# EAGLE design board (EAGLE 6.6.0)
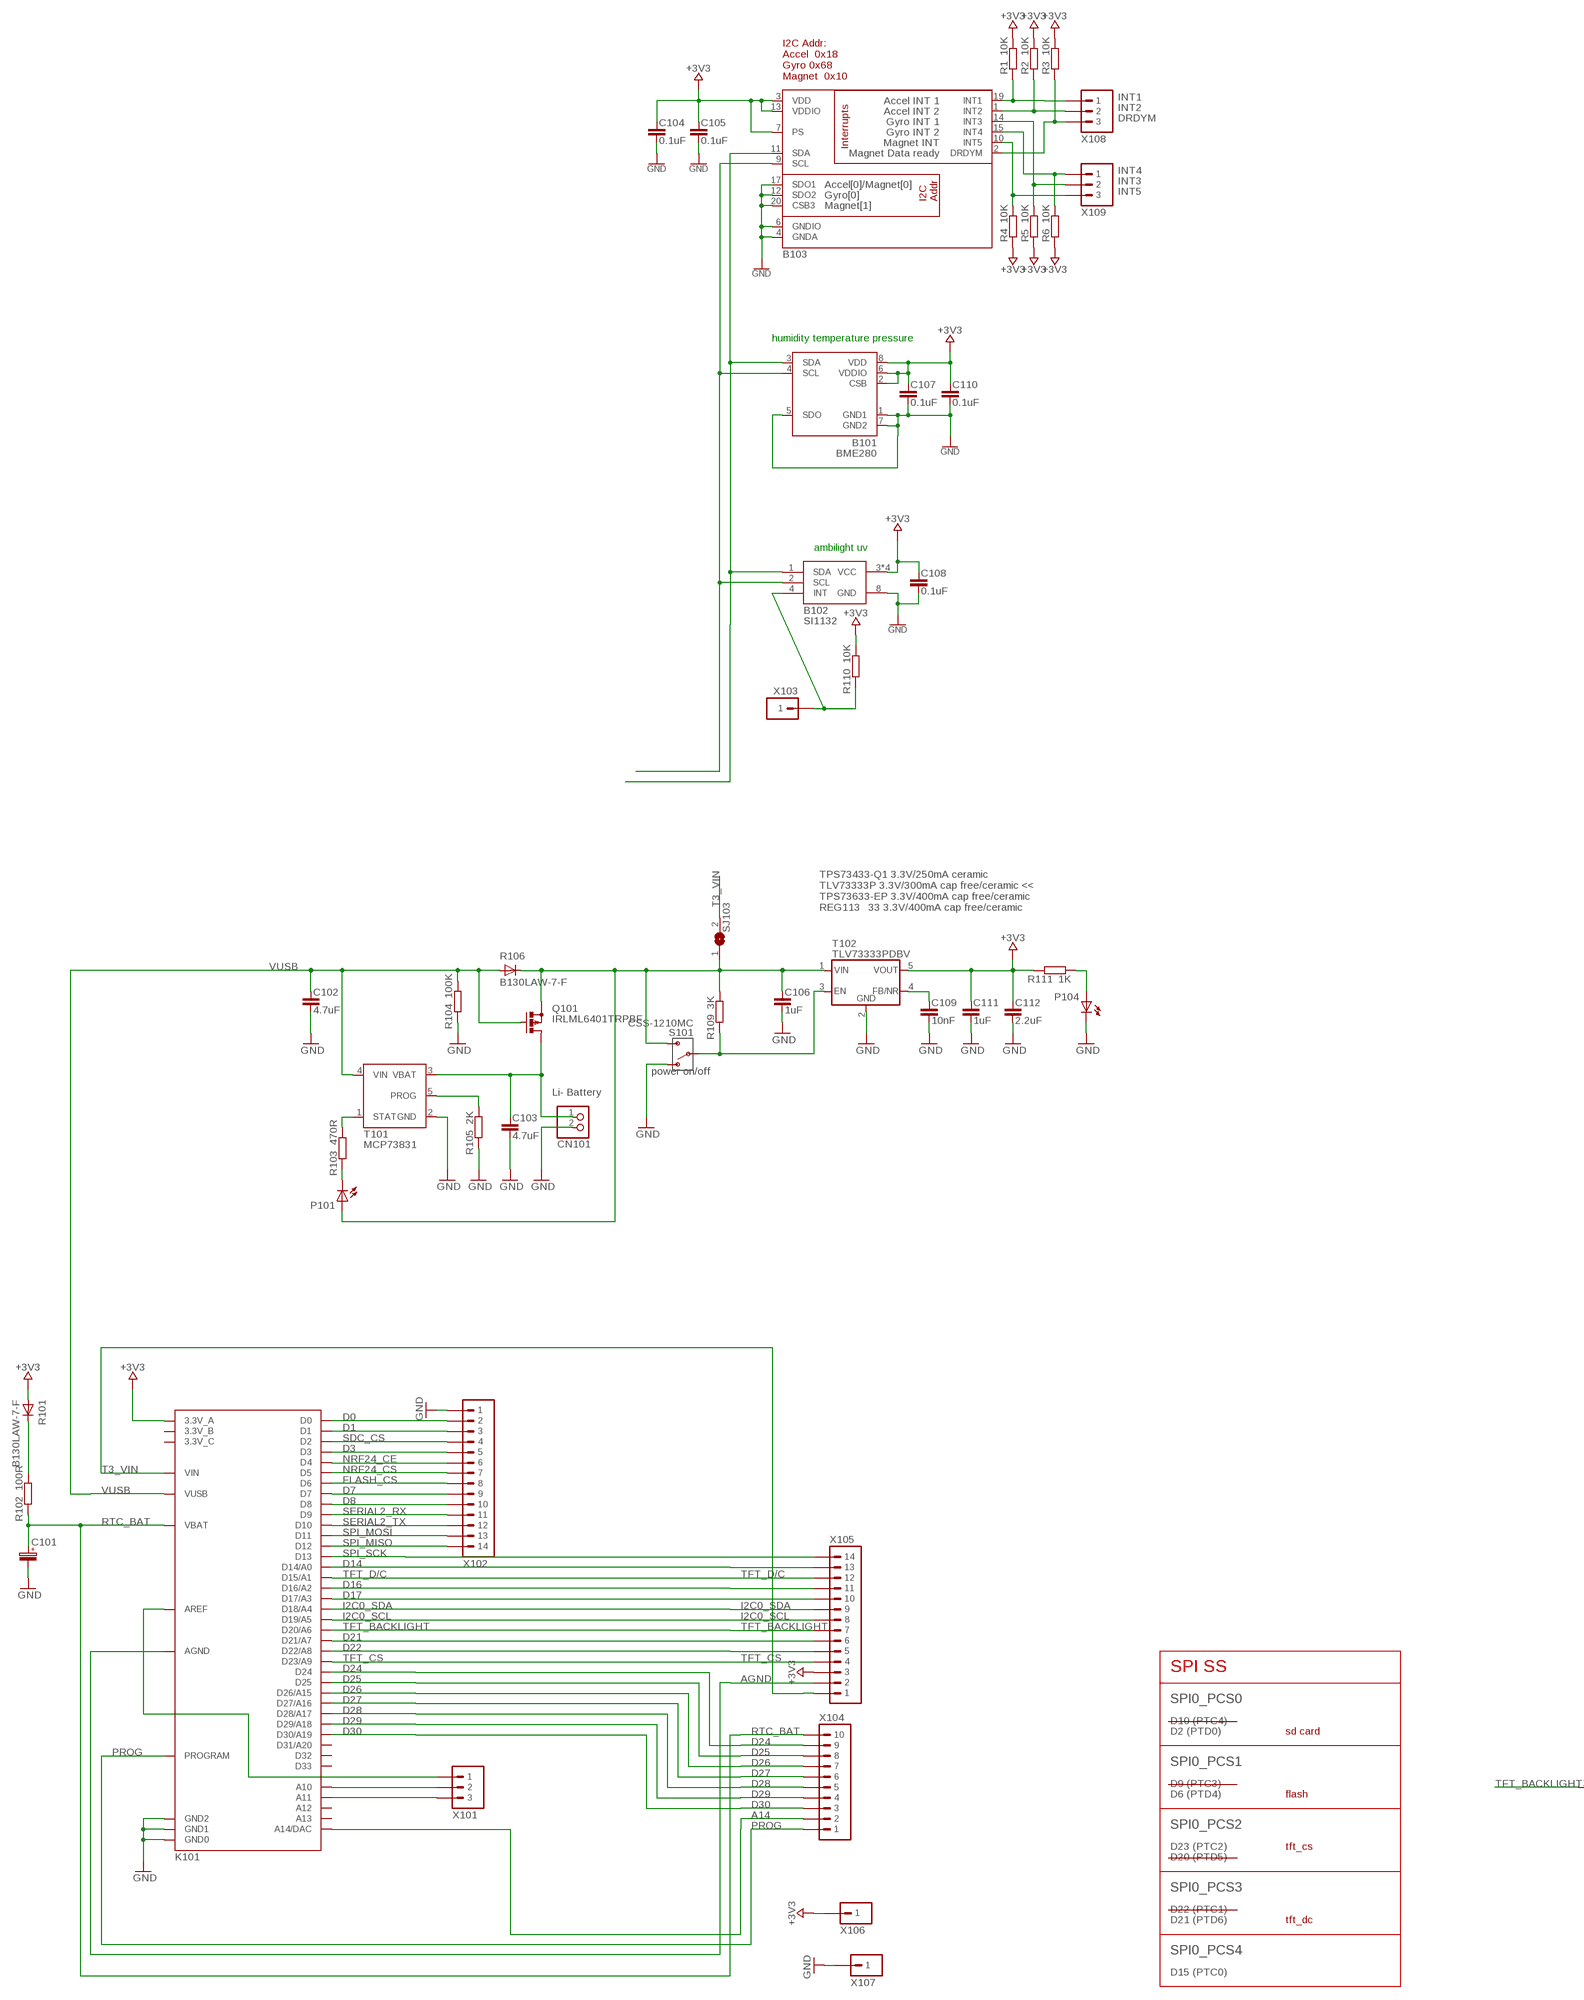
[diagram p0: schematic, sheet 1, part 1 of 2]
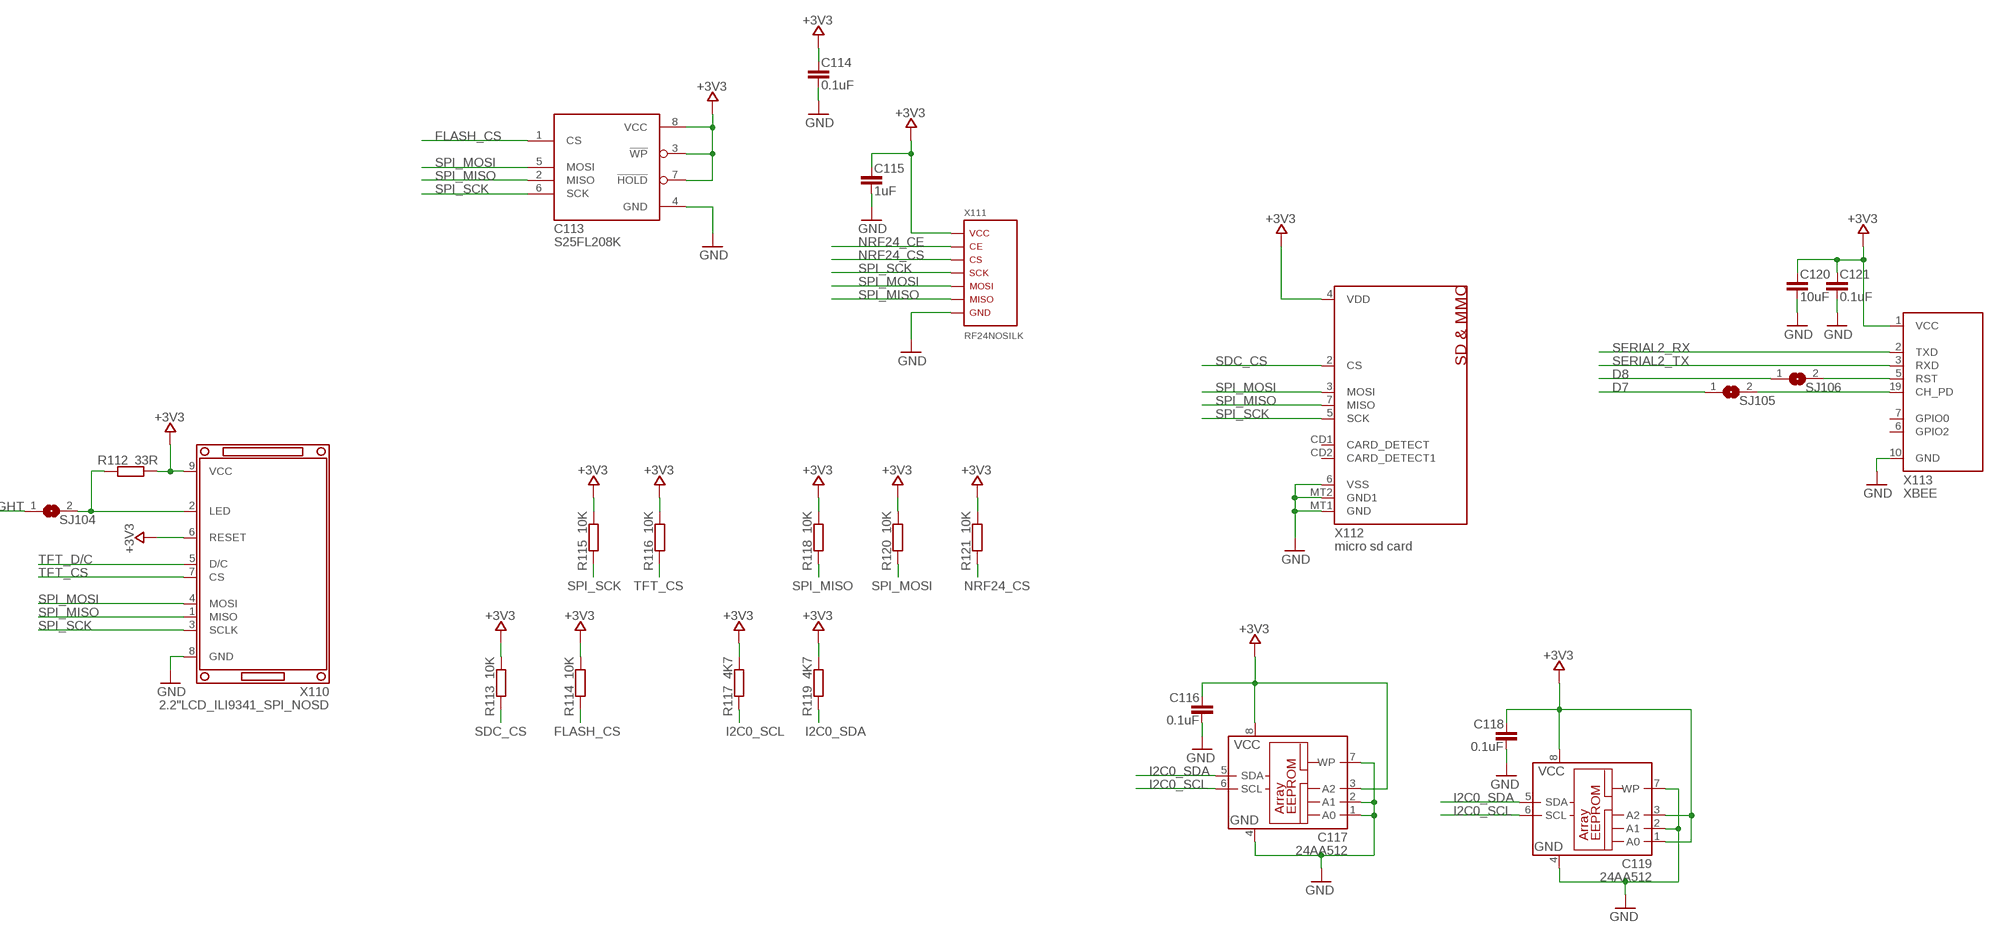
[diagram p1: schematic, sheet 1, part 2 of 2]

## Parts
B101  BME280  BME280_I2CLGA8  [BOSCH_8LGA_0.35X0.35]
B102  SI1132  SI1132QFN10  [SILABS_QFN-10_(ONLY_8PAD)]
B103  BMX055  [BMX055_LGA20]
C101  CAPACITOR_POLCPH3225A  [CPH3225A]
C102  4.7uF  CAPACITORM2012(0805)_G1  [SMT_M2012(0805)_G1]
C103  4.7uF  CAPACITORM2012(0805)_G1  [SMT_M2012(0805)_G1]
C104  0.1uF  CAPACITORM1608(0603)_G1  [SMT_M1608(0603)_G1]
C105  0.1uF  CAPACITORM1608(0603)_G1  [SMT_M1608(0603)_G1]
C106  1uF  CAPACITORM1608(0603)_G1  [SMT_M1608(0603)_G1]
C107  0.1uF  CAPACITORM1608(0603)_G1  [SMT_M1608(0603)_G1]
C108  0.1uF  CAPACITORM1608(0603)_G1  [SMT_M1608(0603)_G1]
C109  10nF  CAPACITORM1608(0603)_G1  [SMT_M1608(0603)_G1]
C110  0.1uF  CAPACITORM1608(0603)_G1  [SMT_M1608(0603)_G1]
C111  1uF  CAPACITORM1608(0603)_G1  [SMT_M1608(0603)_G1]
C112  2.2uF  CAPACITORM2012(0805)_G1  [SMT_M2012(0805)_G1]
C113  S25FL208K  SPI_FLASH-X25XXSOIC_150MIL_2  [SOIC-8]
C114  0.1uF  CAPACITORM1608(0603)_G1  [SMT_M1608(0603)_G1]
C115  1uF  CAPACITORM1608(0603)_G1  [SMT_M1608(0603)_G1]
C116  0.1uF  CAPACITORM1608(0603)_G1  [SMT_M1608(0603)_G1]
C117  24AA512  EEPROM24AAXXXSN  [SOIC-8]
C118  0.1uF  CAPACITORM1608(0603)_G1  [SMT_M1608(0603)_G1]
C119  24AA512  EEPROM24AAXXXSN  [SOIC-8]
C120  10uF  CAPACITORM2012(0805)_G1  [SMT_M2012(0805)_G1]
C121  0.1uF  CAPACITORM1608(0603)_G1  [SMT_M1608(0603)_G1]
CN101  JST_2PIN-SMT-RA  [JST-PH-2-SMT-RA]
K101  TEENSY3.1_ALLPINSNOSILK  [TEENSY3.1_ALLPINS/NOSILK]
P101  LEDSMT_M1608(0603)_LED_G1  [SMT_M1608(0603)_LED_G1]
P104  LEDSMT_M1608(0603)_LED_G1  [SMT_M1608(0603)_LED_G1]
Q101  IRLML6401TRPBF  PFETSOT-23_SPEC1  [SOT23-SPEC1]
R1  10K  RESISTORM1608(0603)_G1  [SMT_M1608(0603)_G1]
R2  10K  RESISTORM1608(0603)_G1  [SMT_M1608(0603)_G1]
R3  10K  RESISTORM1608(0603)_G1  [SMT_M1608(0603)_G1]
R4  10K  RESISTORM1608(0603)_G1  [SMT_M1608(0603)_G1]
R5  10K  RESISTORM1608(0603)_G1  [SMT_M1608(0603)_G1]
R6  10K  RESISTORM1608(0603)_G1  [SMT_M1608(0603)_G1]
R101  B130LAW-7-F  DIODESOD123-V2  [SOD123V2]
R102  100R  RESISTORM1608(0603)_G1  [SMT_M1608(0603)_G1]
R103  470R  RESISTORM1608(0603)_G1  [SMT_M1608(0603)_G1]
R104  100K  RESISTORM1608(0603)_G1  [SMT_M1608(0603)_G1]
R105  2K  RESISTORM1608(0603)_G1  [SMT_M1608(0603)_G1]
R106  B130LAW-7-F  DIODESOD123-V2  [SOD123V2]
R109  3K  RESISTORM1608(0603)_G1  [SMT_M1608(0603)_G1]
R110  10K  RESISTORM1608(0603)_G1  [SMT_M1608(0603)_G1]
R111  1K  RESISTORM1608(0603)_G1  [SMT_M1608(0603)_G1]
R112  33R  RESISTORM1608(0603)_G1  [SMT_M1608(0603)_G1]
R113  10K  RESISTORM1608(0603)_G1  [SMT_M1608(0603)_G1]
R114  10K  RESISTORM1608(0603)_G1  [SMT_M1608(0603)_G1]
R115  10K  RESISTORM1608(0603)_G1  [SMT_M1608(0603)_G1]
R116  10K  RESISTORM1608(0603)_G1  [SMT_M1608(0603)_G1]
R117  4K7  RESISTORM1608(0603)_G1  [SMT_M1608(0603)_G1]
R118  10K  RESISTORM1608(0603)_G1  [SMT_M1608(0603)_G1]
R119  4K7  RESISTORM1608(0603)_G1  [SMT_M1608(0603)_G1]
R120  10K  RESISTORM1608(0603)_G1  [SMT_M1608(0603)_G1]
R121  10K  RESISTORM1608(0603)_G1  [SMT_M1608(0603)_G1]
S101  CSS-1210MC  SLIDE_SWITCH_2WAYCSS-1210(M)C  [CSS-1210(M)C]
SJ103  n/a  JUMPER_2WRESISTOR0603  [SMT_M1608(0603)_G1]
SJ104  n/a  JUMPER_2WRESISTOR0603  [SMT_M1608(0603)_G1]
SJ105  0R  JUMPER_2WRESISTOR0603  [SMT_M1608(0603)_G1]
SJ106  0R  JUMPER_2WRESISTOR0603  [SMT_M1608(0603)_G1]
T101  MCP73831  MCP73831XXXX/OT_(SOT-23)  [SOT23-5_MICROCHIP]
T102  TLV73333PDBV  TPS736XXDBV_1  [R-PDSO-G5]
X101  3P1/MIN_SILK2  [HEADER_1X3_1/MIN_SILK2]
X102  14P1/MIN_SILK2  [HEADER_1X14_1/MIN_SILK2]
X103  1P1/MIN_SILK2  [HEADER_1X1_1/MIN_SILK2]
X104  10P1X10P_1/MIN_SILK2  [HEADER_1X10_1/MIN_SILK2]
X105  14P1/MIN_SILK2  [HEADER_1X14_1/MIN_SILK2]
X106  1P1/MIN_SILK2  [HEADER_1X1_1/MIN_SILK2]
X107  1P1/MIN_SILK2  [HEADER_1X1_1/MIN_SILK2]
X108  3P1/MIN_SILK2  [HEADER_1X3_1/MIN_SILK2]
X109  3P1/MIN_SILK2  [HEADER_1X3_1/MIN_SILK2]
X110  2.2"LCD_ILI9341_SPI_NOSD  [2.2_TFT1]
X111  RF24NOSILK  [RF24_NOSILK]
X112  micro sd card  MICROSD  [MICROSD]
X113  XBEE  EXP-BEE-SMALLPTH  [ESP_BEE_PTH_VCC_GND_RX_TX_PD_RST_IO0_IO2]

## Nets
+3V3 [MOREPOWER]: B101.2(CSB) B101.6(VDDIO) B101.8(VDD) B102.3(VCC) B102.6(VCC) B102.7(VCC) B102.9(VCC) B103.3(VDD) B103.7(PS) B103.13(VDDIO) C104.1 C105.1 C107.1 C108.1 C110.1 C111.1 C112.1 C113.3(!WP) C113.7(!HOLD) C113.8(VCC) C114.1 C115.1 C116.1 C117.3(A2) C117.8(VCC) C118.1 C119.1(A0) C119.3(A2) C119.8(VCC) C120.1 C121.1 K101.3V3_A(3.3V_A) R1.2 R2.2 R3.2 R4.1 R5.1 R6.1 R101.A R110.2 R111.1 R112.2 R113.2 R114.2 R115.2 R116.2 R117.2 R118.2 R119.2 R120.2 R121.2 T102.5(VOUT) X105.3 X106.1 X110.6(RESET) X110.9(VCC) X111.VCC X112.4(VDD) X113.1(VCC)
A14: K101.A14(A14/DAC) X104.2
AGND: K101.AGND X105.2
BAT_CHG_OUT [MOREPOWER]: C106.1 P101.A Q101.2(S) R106.K(C) R109.2 S101.2(S) SJ103.1 T102.1(VIN)
D0: K101.D0 X102.2
D1: K101.D1 X102.3
D3: K101.D3 X102.5
D7: K101.D7 SJ105.1 X102.9
D8: K101.D8 SJ106.1 X102.10
D14: K101.A0(D14/A0) X105.13
D16: K101.A2(D16/A2) X105.11
D17: K101.A3(D17/A3) X105.10
D21: K101.A7(D21/A7) X105.6
D22: K101.A8(D22/A8) X105.5
D24: K101.D24 X104.9
D25: K101.D25 X104.8
D26: K101.D26(D26/A15) X104.7
D27: K101.D27(D27/A16) X104.6
D28: K101.D28(D28/A17) X104.5
D29: K101.D29(D29/A18) X104.4
D30: K101.D30(D30/A19) X104.3
DRDYM: B103.2(DRDYM) R3.1 X108.3
ENABLE_POWER: R109.1 S101.3(P) T102.3(EN)
FLASH_CS: C113.1(CS) K101.D6 R114.1 X102.8
GND [MOREPOWER]: B101.1(GND1) B101.5(SDO) B101.7(GND2) B102.8(GND) B103.4(GNDA) B103.6(GNDIO) B103.12(SDO2) B103.17(SDO1) B103.20(CSB3) C101.- C102.2 C103.2 C104.2 C105.2 C106.2 C107.2 C108.2 C109.2 C110.2 C111.2 C112.2 C113.4(GND) C114.2 C115.2 C116.2 C117.1(A0) C117.2(A1) C117.4(GND) C117.7(WP) C118.2 C119.2(A1) C119.4(GND) C119.7(WP) C120.2 C121.2 CN101.2 K101.GND0 K101.GND1 K101.GND2 P104.C R104.1 R105.1 S101.1(O) T101.2(GND) T102.2(GND) X102.1 X107.1 X110.8(GND) X111.GND X112.6(VSS) X112.MT1(GND) X112.MT2(GND1) X113.10(GND)
I2C0_SCL: B101.4(SCL) B102.2(SCL) B103.9(SCL) C117.6(SCL) C119.6(SCL) K101.A5(D19/A5) R117.1 X105.8
I2C0_SDA: B101.3(SDA) B102.1(SDA) B103.11(SDA) C117.5(SDA) C119.5(SDA) K101.A4(D18/A4) R119.1 X105.9
INT1: B103.19(INT1) R1.1 X108.1
INT2: B103.1(INT2) R2.1 X108.2
INT3: B103.14(INT3) R5.2 X109.2
INT4: B103.15(INT4) R6.2 X109.1
INT5: B103.10(INT5) R4.2 X109.3
IO3: B102.4(INT) R110.1 X103.1
N$1: R105.2 T101.5(PROG)
N$2: R103.2 T101.1(STAT)
N$3: P101.C R103.1
N$4: P104.A R111.2
N$6: SJ106.2 X113.5(RST)
N$7: R101.K(C) R102.2
N$8: SJ105.2 X113.19(CH_PD)
N$10: K101.A11 X101.3
N$11: K101.A10 X101.2
N$12: K101.AREF X101.1
N$13: R112.1 SJ104.2 X110.2(LED)
N$18: C109.1 T102.4(FB/NR)
NRF24_CE: K101.D4 X102.6 X111.CE
NRF24_CS: K101.D5 R121.1 X102.7 X111.CS
PROG: K101.PROG(PROGRAM) X104.1
RTC_BAT: C101.+ K101.VBAT R102.1 X104.10
SDC_CS: K101.D2 R113.1 X102.4 X112.2(CS)
SERIAL2_RX: K101.D9 X102.11 X113.2(TXD)
SERIAL2_TX: K101.D10 X102.12 X113.3(RXD)
SPI_MISO: C113.2(MISO) K101.D12 R118.1 X102.14 X110.1(MISO) X111.MISO X112.7(MISO)
SPI_MOSI: C113.5(MOSI) K101.D11 R120.1 X102.13 X110.4(MOSI) X111.MOSI X112.3(MOSI)
SPI_SCK: C113.6(SCK) K101.D13 R115.1 X105.14 X110.3(SCLK) X111.SCK X112.5(SCK)
T3_VIN [POWER]: K101.VIN SJ103.2 X105.1
TFT_BACKLIGHT: K101.A6(D20/A6) SJ104.1 X105.7
TFT_CS: K101.A9(D23/A9) R116.1 X105.4 X110.7(CS)
TFT_D/C: K101.A1(D15/A1) X105.12 X110.5(D/C)
VBAT [POWER]: C103.1 CN101.1 Q101.3(D) T101.3(VBAT)
VUSB [POWER]: C102.1 K101.VUSB Q101.1(G) R104.2 R106.A T101.4(VIN)
Unconnected: K101.A12 K101.A13 K101.D31(D31/A20) K101.D32 K101.D33 X112.CD1(CARD_DETECT) X112.CD2(CARD_DETECT1) X113.6(GPIO2) X113.7(GPIO0)

## Notes on the sheet
- I2C Addr:
  Accel  0x18
  Gyro 0x68
  Magnet  0x10
- humidity temperature pressure
- ambilight uv
- TPS73433-Q1 3.3V/250mA ceramic
  TLV73333P 3.3V/300mA cap free/ceramic <<
  TPS73633-EP 3.3V/400mA cap free/ceramic
  REG113‑33 3.3V/400mA cap free/ceramic
- power on/off
- Li- Battery
- SPI SS
- SPI0_PCS0
- D10 (PTC4)
- D2 (PTD0) | sd card
- SPI0_PCS1
- D9 (PTC3)
- D6 (PTD4) | flash
- SPI0_PCS2
- D23 (PTC2) | tft_cs
- D20 (PTD5)
- SPI0_PCS3
- D22 (PTC1)
- D21 (PTD6) | tft_dc
- SPI0_PCS4
- D15 (PTC0)

## Power pins joined to a net without a drawn wire
3.3V_B: K101.3V3_B(3.3V_B)
3.3V_C: K101.3V3_C(3.3V_C)

## Library data of the parts
B101 = thewknd:BME280_I2C; OC_FARNELL: unknown
B102 = thewknd:SI1132; OC_FARNELL: unknown
B103 = thewknd:BMX055; OC_FARNELL: unknown
C101 = thewknd:CAPACITOR_POL; OC_FARNELL: unknown
C102 C103 = thewknd:CAPACITOR; DK: CGJ4J2X7R0J475K125AA; MF: AVX; MPN: 0805ZD475KAT2A; OC_FARNELL: 1327701
C104 C105 C107 C108 C110 C114 C116 C118 C121 = thewknd:CAPACITOR; MF: AVX; MPN: 0603YC104K4Z2A; OC_FARNELL: 1301716
C106 C111 C115 = thewknd:CAPACITOR; DK: CGJ4J2X7R0J475K125AA; MF: AVX; MPN: 0603ZD105KAT2A; OC_FARNELL: 1327684
C109 = thewknd:CAPACITOR; DK: CGJ4J2X7R0J475K125AA; MF: MULTICOMP; MPN: MC0603B103K500CT; OC_FARNELL: 1759102
C112 = thewknd:CAPACITOR; DK: CGJ4J2X7R0J475K125AA; MF: KEMET; MPN: C1206C226K9PACTU; OC_FARNELL: 1288265
C113 = thewknd:SPI_FLASH-X25XX: 8pin SPI Flash series x25xx. Works with devices like W25X32 and BR25L32; MF: SPANSION; MPN: S25FL208K0RMFI041; OC_FARNELL: 2340553
C117 C119 = thewknd:EEPROM: 24YYXXXST TSSOP PITCH 0.65MM; MF: MICROCHIP; MPN: 24AA512-I/SM; OC_FARNELL: 1331301
C120 = thewknd:CAPACITOR; DK: LMK316AB7226ML-TR; MF: MULTICOMP; MPN: MCTT31F106Z100CT; OC_FARNELL: 1759485
CN101 = adafruit:JST_2PIN: JST 2-Pin Connectors of various flavors SMT-RA (S2B-PH-SM4) 4UConnector #17311 SMT (B2B-PH-SM4) THM-RA (S2B-PH) THM (B2B-PH); MF: JST (JAPAN SOLDERLESS TERMINALS); MPN: S2B-PH-SM4-TB(LF)(SN); OC_FARNELL: 9492615
K101 = tlib:TEENSY3.1_ALLPINS; OC_FARNELL: unknown
P101 P104 = thewknd:LED; MF: VISHAY SEMICONDUCTOR; MPN: TLMS1100-GS08; OC_FARNELL: 1440338
Q101 = thewknd:PFET: P-CHANNEL MOS FET; MF: INTERNATIONAL RECTIFIER; MPN: IRLML6401TRPBF; OC_FARNELL: 1463267
R1-R6 R113-R116 R118 R120 R121 = thewknd:RESISTOR; MF: VISHAY DRALORIC; MPN: CRCW060310K0FKEA; OC_FARNELL: 1469748
R101 R106 = thewknd:DIODE; DK: B130LAW-7-F; MF: DIODES INC.; MPN: B130LAW-7-F; OC_FARNELL: 1858617
R102 R104 = thewknd:RESISTOR; DK: ERJ-6GEYJ104V; MF: VISHAY DRALORIC; MPN: CRCW060310K0FKEA; OC_FARNELL: 1469748
R103 = thewknd:RESISTOR; MF: VISHAY DRALORIC; MPN: CRCW0603470RFKEA; OC_FARNELL: 1469815
R105 = thewknd:RESISTOR; MF: VISHAY DRALORIC; MPN: CRCW06032K00FKEA; OC_FARNELL: 1469764
R109 = thewknd:RESISTOR; MF: VISHAY DRALORIC; MPN: CRCW06033K00FKEA; OC_FARNELL: 1469790
R110 = thewknd:RESISTOR; OC_FARNELL: unknown
R111 = thewknd:RESISTOR; MF: VISHAY DRALORIC; MPN: CRCW0603330RFKEA; OC_FARNELL: 1469803
R112 = thewknd:RESISTOR; DK: RMCF0805JT10K0; MF: VISHAY DRALORIC; MPN: CRCW0805100RFKEA; OC_FARNELL: 1469862
R117 R119 = thewknd:RESISTOR; DK: RMCF0805JT10K0; MF: VISHAY DRALORIC; MPN: CRCW06034K70FKEA; OC_FARNELL: 1469807
S101 = thewknd:SLIDE_SWITCH_2WAY: right angle, pitch 2mm, size: 3x8.85mm; OC_FARNELL: unknown
SJ103 SJ105 SJ106 = thewknd:JUMPER_2W; OC_FARNELL: unknown
SJ104 = thewknd:JUMPER_2W; DK: RMCF0805JT10K0; OC_FARNELL: unknown
T101 = thewknd:MCP73831; MF: MICROCHIP; MPN: MCP73831T-2ATI/OT; OC_FARNELL: 1834890
T102 = thewknd:TPS736XX; MF: TEXAS INSTRUMENTS; MPN: TLV73333PDBVT; OC_FARNELL: 2455145
X101 X108 X109 = TW_pinheader:3P; OC_FARNELL: unknown
X102 X105 = TW_pinheader:14P; OC_FARNELL: unknown
X103 X106 X107 = TW_pinheader:1P; OC_FARNELL: unknown
X104 = TW_pinheader:10P; OC_FARNELL: unknown
X110 = TW_pinheader:2.2"LCD_ILI9341_SPI_NOSD; OC_FARNELL: unknown
X111 = thewknd:RF24; OC_FARNELL: unknown
X112 = thewknd:MICROSD: Micro-SD / Transflash card holder with SPI pinout For the 3M # 2908-05WB-MG and/or 4UCON #19656 push-push type; MF: GLOBAL CONNECTOR TECHNOLOGY; MPN: MEM2051-00-195-00-A.; OC_FARNELL: 2143377
X113 = ESP8266:EXP-BEE-SMALL; OC_FARNELL: unknown

## Board
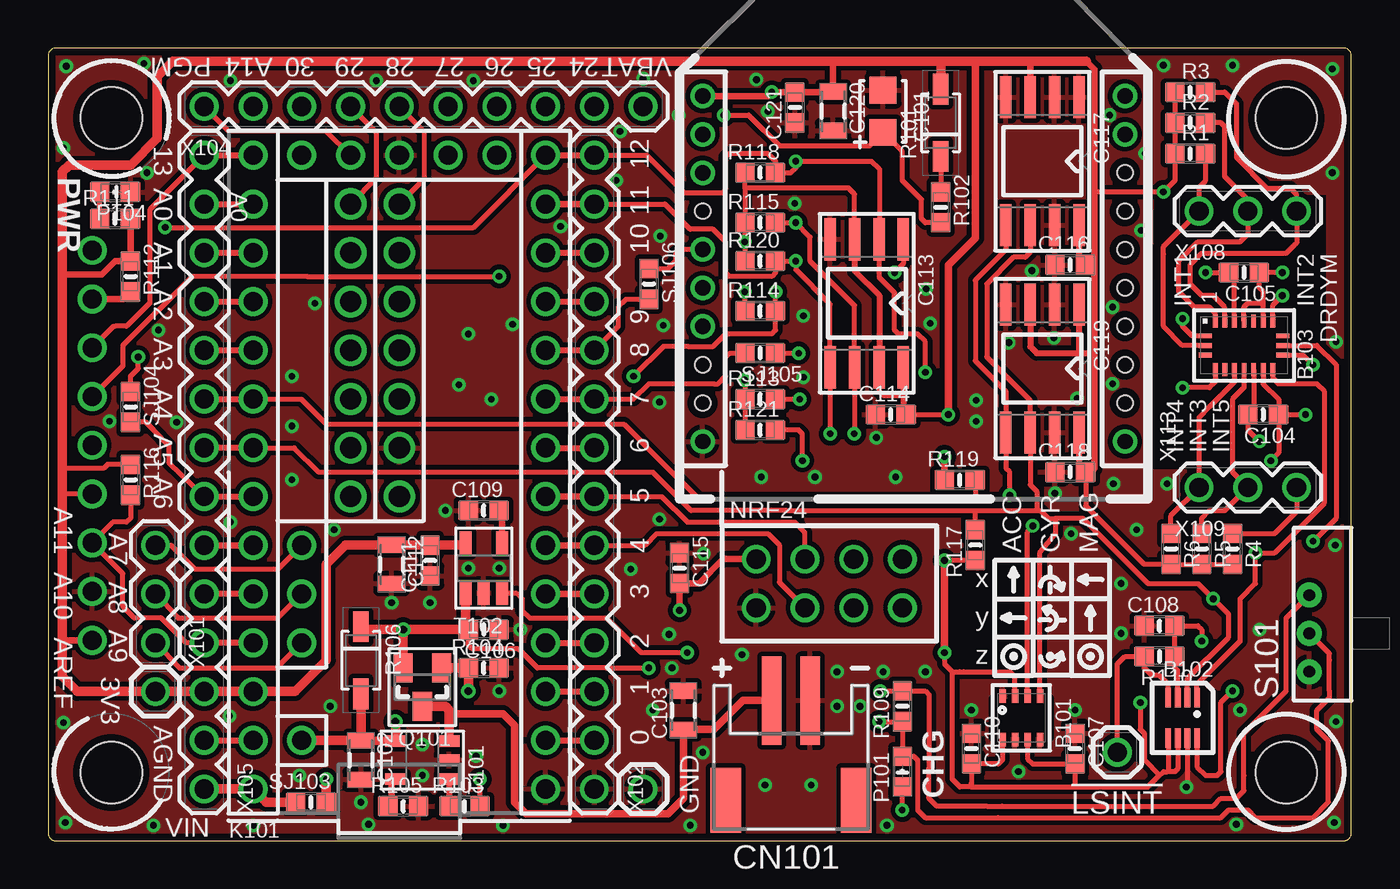
[diagram p2: board, top side]
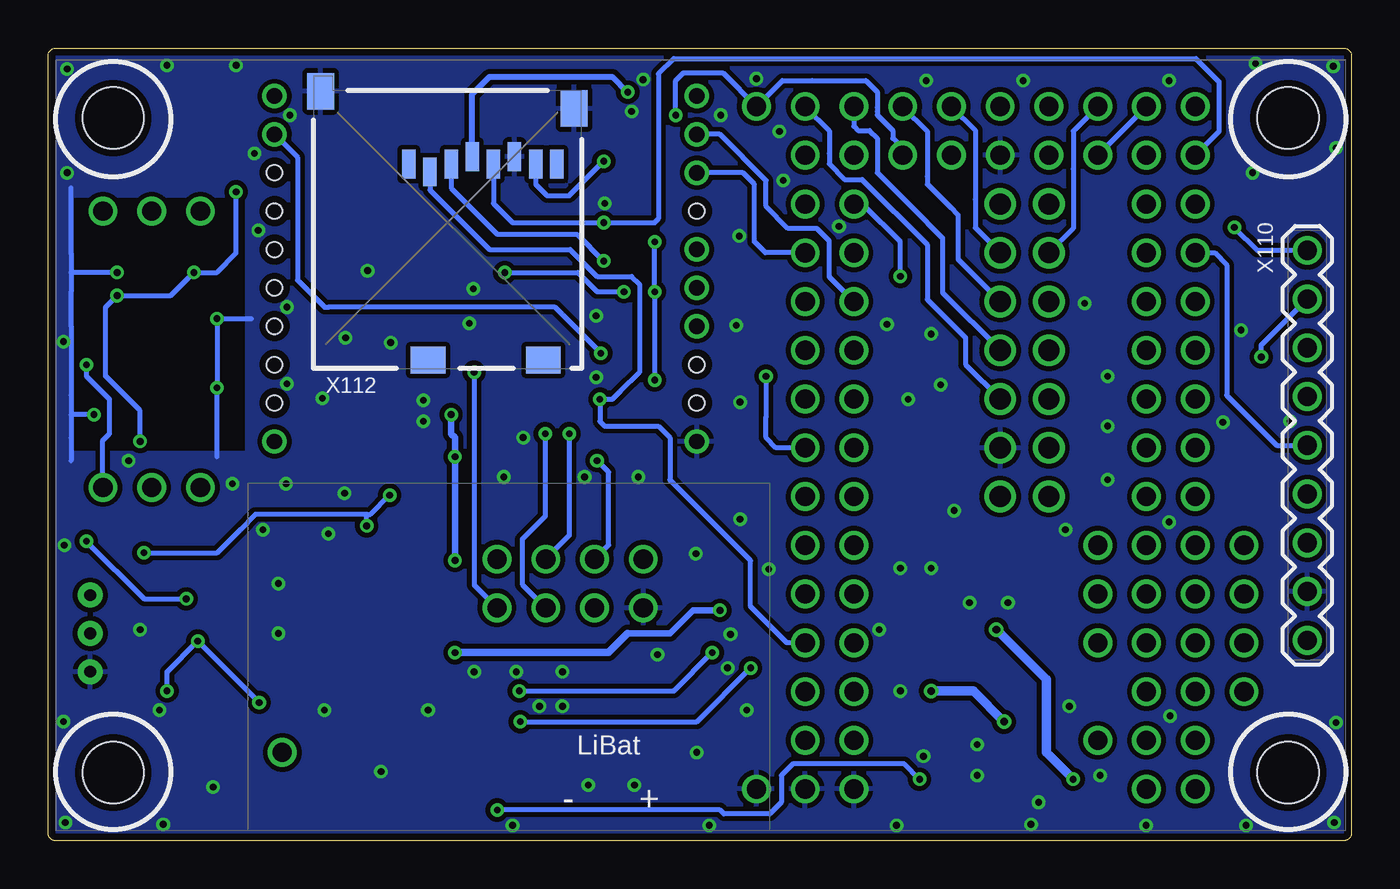
[diagram p3: board, bottom side, seen from below]

Size 67.9 x 41.3 mm. Coordinates in mm from the lower left corner, seen from the top.
Outline: 0,0.4 arc90 0.4,0 67.5,0 arc90 67.9,0.4 67.9,40.9 arc90 67.5,41.3 0.4,41.3 arc90 0,40.9 0,0.4
Copper layers (1*16): Top 0.0356mm / dielectric 1.5011mm / Bottom 0.0356mm
Design rules "LaenPCBOrder": minimum track width 6mil, minimum drill 13mil, track to track 6mil, track to pad 6mil, pad to pad 6mil, via to via 6mil, smd to smd 6mil, copper to edge 15mil, drill to drill 6mil, minimum pad ring 7mil, minimum via ring 7mil, stop-mask expansion 4mil, vias tented up to drill 0mil, thermal gap 10mil

### Footprints (pad centres in the part's own frame; a part is rotated, then mirrored left to right if it is on the bottom)
BOSCH_8LGA_0.35X0.35 = smd 0.7 x 0.35: 1 1.125,0.975; 2 1.125,0.325; 3 1.125,-0.325; 4 1.125,-0.975; 5 -1.125,-0.975; 6 -1.125,-0.325; 7 -1.125,0.325; 8 -1.125,0.975
SILABS_QFN-10_(ONLY_8PAD) = smd 0.3 x 1: 1 -0.75,-1.05; 2 -0.25,-1.05; 3 0.25,-1.05; 4 0.75,-1.05; 6 0.75,1.05; 7 0.25,1.05; 8 -0.25,1.05; 9 -0.75,1.05
BMX055_LGA20 = smd 0.675 x 0.25: 1 1.262,1.5; 2 1.262,1; 3 1.262,0.5; 4 1.262,0; 5 1.262,-0.5; 6 1.262,-1; 7 1.262,-1.5; 11 -1.262,-1.5; 12 -1.262,-1; 13 -1.262,-0.5; 14 -1.262,0; 15 -1.262,0.5; 16 -1.262,1; 17 -1.262,1.5 | smd 0.25 x 0.675: 8 0.5,-2.013; 9 0,-2.013; 10 -0.5,-2.013; 18 -0.5,2.013; 19 0,2.013; 20 0.5,2.013
CPH3225A = smd 1.4 x 1.4: + -1.1,0; - 1.1,0
SMT_M2012(0805)_G1 = smd 0.8 x 1.4: 1 -1,0; 2 1,0
SMT_M1608(0603)_G1 = smd 1 x 0.95: 1 -0.8,0; 2 0.8,0
SOIC-8 = smd 0.6 x 2.2: 1 -1.905,-3.33; 2 -0.635,-3.33; 3 0.635,-3.33; 4 1.905,-3.33; 5 1.905,3.33; 6 0.635,3.33; 7 -0.635,3.33; 8 -1.905,3.33
JST-PH-2-SMT-RA = smd 1 x 4.6: 1 1,-3.7; 2 -1,-3.7 | smd 1.6 x 3.4: NC1 -3.4,1.5; NC2 3.4,1.5
TEENSY3.1_ALLPINS/NOSILK = drill 1 pad 1.5: 3V3_A -11.43,7.62; 3V3_B 16.51,-2.54; A0 13.97,7.62; A1 11.43,7.62; A2 8.89,7.62; A3 6.35,7.62; A4 3.81,7.62; A5 1.27,7.62; A6 -1.27,7.62; A7 -3.81,7.62; A8 -6.35,7.62; A9 -8.89,7.62; A10 -6.35,5.08; A11 -3.81,5.08; A14 16.51,5.08; AGND -13.97,7.62; AREF -8.89,5.08; D0 -13.97,-7.62; D1 -11.43,-7.62; D2 -8.89,-7.62; D3 -6.35,-7.62; D4 -3.81,-7.62; D5 -1.27,-7.62; D6 1.27,-7.62; D7 3.81,-7.62; D8 6.35,-7.62; D9 8.89,-7.62; D10 11.43,-7.62; D11 13.97,-7.62; D12 16.51,-7.62; D13 16.51,7.62; GND0 -16.51,-7.62; GND1 16.51,0; PROG 16.51,2.54; VBAT 16.51,-5.08; VIN -16.51,7.62; VUSB -13.97,5.08 | drill 1.1 pad 1.6: 3V3_C 1.27,2.54; A12 -1.27,0; A13 -1.27,2.54; D24 3.81,0; D25 6.35,0; D26 8.89,0; D27 11.43,0; D28 13.97,0; D29 13.97,2.54; D30 11.43,2.54; D31 8.89,2.54; D32 6.35,2.54; D33 3.81,2.54; GND2 1.27,0
SMT_M1608(0603)_LED_G1 = smd 1 x 0.95: A -0.8,0; C 0.8,0
SOT23-SPEC1 = smd 1 x 1.5: 1 -1,-1; 2 1,-1; 3 0,1
SOD123V2 = smd 1.6 x 0.8: A 1.75,0; K -1.75,0
CSS-1210(M)C = drill 0.6 pad 1.3: 1 -3,0; 2 -1,0; 3 1,0
SOT23-5_MICROCHIP = smd 0.6 x 1.1: 1 -1,-1.4; 2 0,-1.4; 3 1,-1.4; 4 1,1.4; 5 -1,1.4
R-PDSO-G5 = smd 0.62 x 1.22: 1 -0.95,-1.3; 2 0,-1.3; 3 0.95,-1.3; 4 0.95,1.3; 5 -0.95,1.3
HEADER_1X3_1/MIN_SILK2 = drill 1: 1 -2.54,0; 2 0,0; 3 2.54,0
HEADER_1X14_1/MIN_SILK2 = drill 1: 1 -16.51,0; 2 -13.97,0; 3 -11.43,0; 4 -8.89,0; 5 -6.35,0; 6 -3.81,0; 7 -1.27,0; 8 1.27,0; 9 3.81,0; 10 6.35,0; 11 8.89,0; 12 11.43,0; 13 13.97,0; 14 16.51,0
HEADER_1X1_1/MIN_SILK2 = drill 1: 1 0,0
HEADER_1X10_1/MIN_SILK2 = drill 1: 1 -11.43,0; 2 -8.89,0; 3 -6.35,0; 4 -3.81,0; 5 -1.27,0; 6 1.27,0; 7 3.81,0; 8 6.35,0; 9 8.89,0; 10 11.43,0
2.2_TFT1 = drill 1: 1 -31.6,-10.16; 2 -31.6,-7.62; 3 -31.6,-5.08; 4 -31.6,-2.54; 5 -31.6,0; 6 -31.6,2.54; 7 -31.6,5.08; 8 -31.6,7.62; 9 -31.6,10.16 | hole 3.2: -30.6,17.05; 30.6,17.05; 30.6,-17.05; -30.6,-17.05
RF24_NOSILK = drill 1: CE -1.27,1.27; CS 1.27,1.27; GND -1.27,3.81; MISO -1.27,-3.81; MOSI 1.27,-1.27; NC 1.27,-3.81; SCK -1.27,-1.27; VCC 1.27,3.81
MICROSD = smd 0.7 x 1.5: 1 9,-10.64; 2 7.9,-10.24; 3 6.8,-10.64; 4 5.7,-11.04; 5 4.6,-10.64; 6 3.5,-11.04; 7 2.4,-10.64; 8 1.3,-10.64 | smd 1.8 x 1.4: CD1 2,-0.44; CD2 8,-0.44 | smd 1.4 x 1.9: MT1 0.4,-13.54; MT2 13.6,-14.44
ESP_BEE_PTH_VCC_GND_RX_TX_PD_RST_IO0_IO2 = drill 0.8 pad 1.27: 1 1.2,21; 2 1.2,19; 3 1.2,17; 5 1.2,13; 6 1.2,11; 7 1.2,9; 10 1.2,3; 11 23.2,3; 19 23.2,19; 20 23.2,21 | hole 0.8: 1.2,5; 1.2,7; 1.2,15; 23.2,5; 23.2,7; 23.2,9; 23.2,11; 23.2,13; 23.2,15; 23.2,17

### Placement (x,y rotation side)
B101  50.7,6.4 90 top
B102  59.1,6.4 180 top
B103  62.3,25.8 90 top
C101  43.5,38 90 top
C102  16.3,4.2 270 top
C103  33.1,6.8 90 top
C104  63.3,22.2 0 top
C105  62.3,29.6 0 top
C106  22.7,11 0 top
C107  53.5,4.8 90 top
C108  57.9,11.2 180 top
C109  22.7,17.2 180 top
C110  48.1,4.8 90 top
C111  19.9,14.6 270 top
C112  17.9,14.4 270 top
C113  42.65,28 180 top
C114  43.9,22.2 180 top
C115  32.9,14.2 90 top
C116  53.25,30 180 top
C117  51.8,35.4 180 top
C118  53.25,19.2 180 top
C119  51.8,24.6 180 top
C120  40.9,38 270 top
C121  38.9,38.2 270 top
CN101  38.7,3.6 180 top
K101  18.3,19.2 90 top
P101  44.5,3.6 270 top
P104  3.5,33.8 0 top
Q101  19.5,8 180 top
R1  59.5,35.8 180 top
R2  59.5,37.4 180 top
R3  59.5,39 180 top
R4  61.7,15.2 90 top
R5  60.1,15.2 90 top
R6  58.5,15.2 90 top
R101  46.5,37.4 90 top
R102  46.5,33 90 top
R103  21.7,1.8 180 top
R104  22.7,9 180 top
R105  18.5,1.8 180 top
R106  16.3,9.4 270 top
R109  44.5,7 270 top
R110  57.9,9.6 0 top
R111  3.5,32.4 180 top
R112  4.3,29.4 90 top
R113  37.1,23 180 top
R114  37.1,27.6 180 top
R115  37.1,32.2 180 top
R116  4.3,18.8 90 top
R117  48.3,15.4 270 top
R118  37.1,34.8 180 top
R119  47.5,18.8 180 top
R120  37.1,30.2 180 top
R121  37.1,21.4 180 top
S101  65.7,11.8 90 top
SJ103  13.7,2 180 top
SJ104  4.3,22.6 90 top
SJ105  37.1,25.4 0 top
SJ106  31.3,29 90 top
T101  19.5,4.2 90 top
T102  22.7,14.2 0 top
X101  5.6,12.85 90 top
X102  28.46,19.2 90 top
X103  55.7,4.6 0 top
X104  19.57,38.25 0 top
X105  8.14,19.2 90 top
X106  5.6,7.77 0 top
X107  31,2.69 0 top
X108  62.5,32.8 0 top
X109  62.5,18.4 0 top
X110  33.9,20.6 180 bottom
X111  40.7,13.4 90 top
X112  40.1,24.6 180 bottom
X113  32.9,17.8 0 top

### Tracks (layer width: path | path; a pad name or v marks a point on that pad's centre or on a via)
+3V3  (via drill 0.35)
  Top 0.25: 0.79,18.11 0.84,18.06 X110.6 | R116.2 3.1,19.6 2.9,19.4 0.75,19.4 | C113.3 42.02,33.69 41.7,34 36.3,34 | R114.2 v36.3,28.6 | R120.2 v36.3,31.2 R115.2 36.3,34 | B101.6 51.02,4.28 51.3,4 C107.1 53.5,2.8 | B101.8 49.73,4.23 49.5,4 C110.1 48.1,3 48.1,2.8 | 48.1,2.8 53.5,2.8 | B102.9 59.85,3.85 60.3,3.4 60.9,3.4 61.1,3.6 61.1,7.2 v61.7,7.8 | B102.7 58.85,3.75 58.7,3.6 58.3,3.6 | B102.6 58.35,3.65 58.3,3.6 | 48.1,2.8 47.5,2.8 47.1,3.2 47.1,8.8 | 47.1,8.8 47.5,8.8 47.7,8.8 50.1,8.8 50.38,8.52 B101.2 | B102.3 58.85,8.85 58.7,9 R110.2 C108.1 59.9,11.2 60.1,11 v60.1,10.4 | 57.9,3.4 57.3,2.8 56.9,2.8 53.5,2.8 | 57.9,3.4 58.1,3.6 58.3,3.6 | B103.13 62.8,22.5 C104.1 62.5,21.4 v63.1,20.8 | B103.3 61.8,29.3 C105.1 v60.3,29.6 | B103.7 63.8,27.9 v64.3,28.4 | 36.3,34 R118.2 | C114.1 v46.9,22.2 | v36.3,24 R113.2 R121.2 | R117.2 v46.7,14.6 | v46.7,9.8 46.7,9.2 47.1,8.8 | v56.9,7.2 56.9,5.8 57.1,5.6 57.1,4.2 57.9,3.4 | C113.7 43.29,23.41 43.5,23.2 44.55,23.2 | 54.5,33.8 v58.1,33.8 58.7,34.4 R1.2 R2.2 R3.2 | R4.1 R5.1 R6.1 57.1,14.4 54.1,17.4 54.05,17.45 C118.1
  Top 0.3: C117.8 53.7,30.14 C116.1 54.5,30 | C119.8 53.7,19.14 C118.1 | C119.3 51.16,25.73 51.5,25.4 53.7,25.4 | C119.1 53.7,25.4 | C113.3 42.02,29.68 43.3,28.4 43.3,26.2 43.3,24.68 C113.7 | C113.8 44.55,23.2 44.55,22.54 C114.1 | 53.7,25.4 54.5,25.4
  Top 0.35: 0.79,18.11 0.75,18.2 | X113.1 37.5,38.8 v37.7,39 38.3,39 C121.1 C120.1 40.9,40.6 | X110.9 0.74,10.44 0.75,10.4 | C117.3 51.16,40.54 51.1,40.6 | 54.1,40.6 54.5,40.2 54.5,33.8 54.5,30 54.5,25.4 54.5,19.4 54.3,19.2 C118.1 | v32.9,12 C115.1 33.9,13.4 35.17,14.67 X111.VCC | v46.7,20 R119.2 | R111.1 R112.2 3.5,30.2 2.8,29.5 1.85,29.5 0.85,29.5 0.75,29.6
  Top 0.4: 48.3,40.6 48.3,31.4 46.9,30 v46.9,22.2 | v46.7,9.8 46.7,11.2 46.7,13 46.7,13.2 v46.7,14.6
  Top 0.5: 0.75,32.4 0.75,29.6 0.75,29.39 0.75,24.6 0.75,24.55 0.75,19.4 0.75,18.2 0.75,10.4 0.75,8.55 1.53,7.77 X106.1 X105.3 K101.3V3_A 12.87,7.77 14.5,9.4 14.5,14.4 15.5,15.4 C112.1 C111.1 21.65,15.4 T102.5 | 0.75,32.4 0.75,33.45 0.75,32.4 | 0.75,32.4 0.75,33.8 0.75,34.85 1.1,35.2 3.5,35.2 4.3,35.2 5.7,36.6 5.7,39.8 6.5,40.6 40.9,40.6 46.5,40.6 | 54.1,40.6 51.1,40.6 48.3,40.6 46.5,40.6 | R101.A 46.5,40.6
  Bottom 0.25: v36.3,31.2 v36.3,28.6 v36.3,24 | v61.7,7.8 61.7,8.8 v60.1,10.4 v56.9,7.2 | v63.1,20.8 63.1,22.4 64.9,24.2 64.9,27.8 v64.3,28.4 61.5,28.4 v60.3,29.6 59.1,29.6 58.1,30.6 58.1,32.8 v58.1,33.8
  Bottom 0.3: X112.4 45.8,38.9 44.9,39.8 38.5,39.8 v37.7,39
  Bottom 0.35: v32.9,12 34.3,12 35.5,10.8 37.7,10.8 | v46.9,22.2 46.9,21.2 46.7,21 v46.7,20 v46.7,14.6
  Bottom 0.4: 37.7,10.8 38.7,9.8 v46.7,9.8
A14
  Bottom 0.25: K101.A14 X104.2
AGND
  Top 0.3: X105.2 K101.AGND
BAT_CHG_OUT  (via drill 0.35, 0.4)
  Top 0.25: C106.1 21.9,10.2 22.1,10 24.5,10 24.7,9.8 25.5,9 29.1,9 v31.3,9 | v43.3,6.2 R109.2 P101.A 45.1,4.4 45.3,4.2 45.3,1.6 45.7,1.2 49.5,1.2 61.1,1.2 61.5,1.6 62.5,1.6 62.9,1.2 65.9,1.2 66.7,2 66.7,5.2 66.1,5.8 66.1,6.8 66.75,7.45 66.75,7.8 66.75,9.4 66.75,9.75 S101.2
  Top 0.5: v18.5,11 C106.1 21.75,11.15 T102.1 | v18.5,11 17.9,11 16.25,11 R106.K | Q101.2 v18.5,11 | SJ103.1 v14.5,3.2
  Bottom 0.25: v43.3,6.2 34.1,6.2 v31.3,9
  Bottom 0.5: v14.5,3.2 15.9,4.6 15.9,8.4 v18.5,11
D0
  Top 0.3: K101.D0 X102.2
D1
  Top 0.3: K101.D1 X102.3
D3
  Top 0.35: K101.D3 X102.5
D7
  Top 0.25: X102.9 30.5,23 31.3,23.8 34.7,23.8 34.9,23.8 35.3,24.2 35.3,25.2 35.5,25.4 SJ105.1
  Top 0.3: K101.D7 X102.9
D8
  Top 0.25: SJ106.1 30.1,28.2 29.7,27.8 29.7,26.79 X102.10
  Top 0.3: K101.D8 X102.10
D14
  Top 0.3: X105.13 K101.A0
D16
  Top 0.3: X105.11 K101.A2
D17
  Top 0.3: X105.10 K101.A3
D21
  Top 0.35: K101.A7 X105.6
D22
  Top 0.3: K101.A8 X105.5
D24
  Bottom 0.25: X104.9 27.2,36.99 27.2,35.8 27.2,35.25 26.4,34.45 25.5,34.45 22.1,31.05 22.1,28.2 20.1,26.2 20.1,25 20.1,24.81 K101.D24
D25
  Bottom 0.25: K101.D25 21.3,28.55 21.3,31.4 22.9,33 24.7,34.8 24.7,36.6 25.1,37 25.7,37 25.92,37.22 X104.8
D26
  Bottom 0.25: X104.7 22.1,36.97 22.1,34.6 22.1,34.2 20.9,33 20.5,32.6 20.5,30.29 K101.D26
D27
  Bottom 0.25: X104.6 19.6,37.01 19.6,33.4 19.6,31.93 K101.D27
D28
  Top 0.25: X104.5 19.6,36.95 19.6,35.6 19.6,34.47 K101.D28
D29
  Top 0.25: X104.4 17.1,36.91 17.1,35.4 17.1,34.51 K101.D29
D30
  Bottom 0.25: X104.3 14.5,36.97 14.5,35 14.5,31.89 K101.D30
DRDYM
  Top 0.25: B103.2 61.3,27.8 60.7,28.4 60.1,28.4 59.5,29 59.5,30 60.1,30.6 64.5,30.6 64.9,31 65.04,31.14 X108.3 65.04,33.66 64.7,34 63.5,34 61.9,35.6 61.9,38.4 61.3,39 R3.1
ENABLE_POWER  (via drill 0.35)
  Top 0.25: T102.3 24.4,12.9 24.7,12.6 24.7,12 25.1,11.6 29.1,11.6 30.9,9.8 v33.3,9.8 | v43.35,7.8 R109.1 45.7,7.8 45.9,7.6 45.9,3.8 45.9,2.2 46.3,1.8 48.9,1.8 49.7,1.8 60.7,1.8 61.1,2.2 61.9,2.2 62.3,2.6 62.3,3.4 62.3,5.6 64.5,7.8 64.5,11.6 S101.3
  Bottom 0.25: v43.35,7.8 35.3,7.8 v33.3,9.8
FLASH_CS  (via drill 0.35)
  Top 0.25: C113.1 44.55,30.05 v44.1,29.6 | v30.5,24.2 32.05,25.75 33.35,25.75 34.65,25.75 35.3,26.4 37.7,26.4 37.9,26.6 R114.1 v37.9,28.6
  Top 0.3: K101.D6 X102.8
  Bottom 0.25: v30.5,24.2 30.5,22.09 30.5,21 29.97,20.47 X102.8 | v44.1,29.6 40.3,29.6 39.3,28.6 v37.9,28.6
GND  (via drill 0.35)
  Top 0.25: B103.4 62.3,27.8 62.5,28 63.3,28 | B103.6 63.3,28 | 63.3,28 63.3,28.6 63.1,28.8 C105.2 v64.3,29.6 | B103.12 63.3,23.8 64.1,23 C104.2 | C104.2 v65.5,22.2 | B103.17 60.8,23.9 60.5,23.6 v59.1,23.6 | B103.20 59.6,26.3 59.1,26.8 v59.1,27.2 | C104.2 64.1,20.2 v63.7,19.8 | B102.8 59.35,2.85 v59.3,2.8
  Bottom 0.25: 66.7,19.8 66.7,21 66.7,22.2 | 66.7,34 66.7,30.6 66.7,29.6 | 59.1,20 v59.1,23.6 v59.1,27.2 57.3,27.2 | 66.7,29.6 66.7,28.6 66.7,26.8 66.7,23.2 66.7,22.2 | v65.5,22.2 66.7,22.2 | v64.3,29.6 66.7,29.6
  other vias: 58.1,40.4 23.1,23 3.2,21.85 24.2,26.9 13.9,28 6.7,21.8 5.75,26.6 37.35,2.9 34.1,4.6 19.5,3.4 21.9,14.2 66.9,40.2 26.7,32 29.8,36.95 5.15,34.8 9.45,6.5 0.8,6.15 36.9,39.65 43.15,21 31.9,31.5 9.5,16.6 41.1,8.8 41.1,7 31.5,6.8 14.7,7 16.3,2 17.9,12.4 20.7,17.2 24.6,11 23.5,7.8 22.3,4.4 13.1,3.4 23.7,0.8 32.5,9 39.75,2.9 37.5,38 50.05,25.95 48.35,22.95 48.35,21.85 31.85,16.75 14.9,16.2 12.7,18.8 12.7,21.6 12.7,24.2 21.9,26.4 17.1,39.6 9.5,39.6 22.15,39.6 32.85,37.8 31,39.7 29.6,34.4 48.1,6.8 50.55,3.6 53.5,6.8 63.1,11 55.9,13.4 45.7,8.8 52.45,18.1 56.7,16.2 67.05,15.4 67,0.95 62.1,6.8 43.7,0.8 52.4,26.2 21.4,23.75 31.85,22.85 58.3,18.6 61.7,40.4 66.9,34.8 67.1,26 67.1,6.2 33.45,0.8 10.7,0.8 5.5,0.8 0.8,36.1 5,40.5 0.95,40.35 0.9,0.95 16.7,0.85 61.9,0.85 57.15,35.8 55.45,27.8 55.45,23.8 53.6,23.05 38.9,33.2 45.95,26.95 51.25,29.7 39.35,27.35 39.35,24.15 37.15,18.95 44.15,18.95 30.35,14.15 39.95,18.95 32.35,10.75 43.5,8.8 42.3,7 34.15,14.95 32.05,26.85 55.5,18.6 53.3,16 55.9,10.8 45.75,28.75 55.3,37.8 56.95,31.8 19.9,12.4 19.5,5 23.5,14.2 36.15,9.7
  pour Bottom (isolate 0.25, rank 5): -2.7,44.2 -2.7,-1.6 72.1,-1.6 72.1,20.2 57.5,20.2 57.5,33.6 71.9,33.6 72.1,33.8 72.1,44.2
  pour Top (isolate 0.25, rank 5): -4.1,46.4 -3.9,-4.4 74.7,-4.4 74.3,19.2 57.3,19.2 57.5,33.8 68.7,33.8 69.1,34.2 68.9,46.4
  pour Bottom (isolate 0.25, rank 5): 73.1,35 66.7,35 66.7,19.8 73.1,19.8
  pour Top (isolate 0.25, rank 5): 74.1,35.6 66.7,35.6 66.7,16.2 74.1,16.2
I2C0_SCL  (via drill 0.35)
  Top 0.25: K101.A5 12.83,20.47 14.1,19.2 23.9,19.2 31.5,19.2 33.5,17.2 38.5,17.2 48.3,17.2 | C117.6 51.16,30.66 50.9,30.4 50.3,30.4 48.9,29 48.9,25.2 51.16,22.93 C119.6 51.16,18.54 51.5,18.2 51.5,17.2 | 48.3,17.2 50.1,17.2 50.7,17.2 50.9,17.2 51.5,17.2 | B102.2 59.35,8.45 61.5,10.6 61.5,11.8 v60.7,12.6 | 51.5,17.2 51.7,17.2 52.1,16.8 52.5,16.8 | 52.5,16.8 52.5,16 51.68,15.02 B101.4 | B103.9 66.1,25.8 67.1,24.8 67.1,16.8 v65.9,15.6 | R117.1 48.3,17.2 | 52.5,16.8 53.9,16.8 57.3,13.4 59.9,13.4 | 59.9,13.4 v60.7,12.6 | 59.9,13.4 v60.7,12.6
  Top 0.3: K101.A5 X105.8
  Bottom 0.25: v65.9,15.6 62.9,12.6 v60.7,12.6
I2C0_SDA  (via drill 0.35)
  Top 0.25: K101.A4 13.19,23.01 14.5,21.7 22.6,21.7 30,21.7 31.7,20 33.9,17.8 37.9,17.8 48.3,17.8 | C117.5 49.9,30.79 48.3,29.2 48.3,25 49.9,23.4 C119.5 | C119.5 | C119.5 49.9,19.4 50.1,19.2 v50.1,18 49.9,17.8 48.3,17.8 | 51.02,7.73 B101.3 51.02,16.07 v51.3,16.4 | B102.1 59.85,8.15 62.1,10.4 62.1,12.6 62.9,13.4 v62.9,15 63.9,15 66.5,17.6 66.5,23.4 66.1,23.8 64.1,23.8 63.8,24.1 B103.11 | R119.1 48.3,17.8
  Top 0.3: X105.9 K101.A4
  Bottom 0.25: 51.3,17 55.9,17 57.1,17 57.9,16.2 59.1,15 v62.9,15 | v51.3,16.4 51.3,17 | 51.3,17 51.1,17 v50.1,18
INT1
  Top 0.25: B103.19 59.1,25.8 58.1,26.8 58.1,30.54 58.1,30.94 X108.1 59.96,34.06 60.3,34.4 R1.1
INT2
  Top 0.25: B103.1 60.8,27.5 60.5,27.8 59.7,27.8 58.9,28.6 58.9,30.2 59.9,31.2 62.1,31.2 62.3,31.4 62.5,31.6 X108.2 62.5,33.4 61.3,34.6 61.3,37.2 61.1,37.4 R2.1
INT3
  Top 0.25: B103.14 62.3,23.6 61.7,23 61.7,19.2 X109.2 61.3,17.2 60.5,17.2 60.1,16.8 R5.2
INT4
  Top 0.25: B103.15 61.8,23.9 60.5,22.6 59.96,22.06 X109.1 58.5,16.94 R6.2
INT5  (via drill 0.35)
  Top 0.25: B103.10 65.4,25.3 v65.9,24.8 | R4.2 63.9,16 65.04,17.14 X109.3
  Bottom 0.25: v65.9,24.8 65.9,24.2 64.7,23 64.7,21.2 65.04,20.86 X109.3
IO3
  Top 0.25: B102.4 58.35,8.15 57.9,8.6 57.5,8.6 57.1,9 R110.1 56.1,9.6 55.7,9.2 X103.1
N$1
  Top 0.35: R105.2 17.9,2 17.9,3 T101.5
N$2
  Top 0.3: T101.1 R103.2
N$3  (via drill 0.35)
  Top 0.25: R103.1 v22.5,3.2 | v44.5,1.6 P101.C
  Bottom 0.25: v22.5,3.2 23.3,4 29.1,4 29.7,3.4 29.7,2 30.3,1.4 32.7,1.4 32.9,1.6 v44.5,1.6
N$4
  Top 0.25: R111.2 P104.A
N$6
  Top 0.25: SJ106.2 32.3,29.8 32.7,30.2 32.7,30.6 32.9,30.8 X113.5
N$7
  Top 0.25: R101.K R102.2
N$8  (via drill 0.35)
  Top 0.25: SJ105.2 v39.1,25.4
  Bottom 0.25: v39.1,25.4 41.1,27.4 41.5,27.8 53.3,27.8 53.5,27.8 54.9,29.2 54.9,35.6 X113.19
N$10
  Top 0.25: X101.3 6.41,15.39 7.65,14.15 11.98,14.15 K101.A11
N$11
  Top 0.25: X101.2 6.78,11.6 11.97,11.6 K101.A10
N$12
  Top 0.25: X101.1 6.84,9 11.91,9 K101.AREF
N$13  (via drill 0.35)
  Top 0.25: SJ104.2 4.3,24.2 4.5,24.4 4.7,24.6 v4.7,25.2
  Top 0.35: X110.2 3.92,28.22 R112.1
  Bottom 0.25: v4.7,25.2 4.7,25.82 X110.2
N$18
  Top 0.35: T102.4 23.65,17.05 C109.1
NRF24_CE
  Top 0.25: X102.6 31.09,15.39 31.7,16 37.5,16 38.1,15.4 38.1,13.46 X111.CE
  Top 0.35: K101.D4 X102.6
NRF24_CS  (via drill 0.35)
  Top 0.25: X102.7 31.97,17.93 33.3,16.6 38.9,16.6 39.43,16.07 X111.CS | v39.3,19.8 39.3,21.2 39.1,21.4 R121.1
  Top 0.35: K101.D5 X102.7
  Bottom 0.25: X111.CS 38.7,15.4 38.7,19.2 v39.3,19.8
PROG
  Top 0.25: X104.1 9.39,37 11.5,37 14.47,37 K101.PROG
RTC_BAT  (via drill 0.35)
  Top 0.25: v35.2,37.8 36.5,37.8 38.1,36.2 42.8,36.2 C101.+ 44.5,35.9 44.5,34.4 45.5,33.4 45.5,32.4 45.7,32.2 R102.1
  Bottom 0.25: K101.VBAT 23.38,36.08 23.9,36.6 23.9,37 24.7,37.8 24.7,38 24.7,38.2 24.7,39 25.3,39.6 28.1,39.6 29.65,39.6 X104.10 32.75,40 34.8,40 35.2,39.6 v35.2,37.8
SDC_CS  (via drill 0.35)
  Top 0.25: R113.1 v39.15,23
  Top 0.3: K101.D2 X102.4
  Bottom 0.25: X112.2 48,33.9 44.9,30.8 40.7,30.8 39.3,29.4 37.5,29.4 37.1,29 37.1,24.4 38.1,23.4 38.5,23 v39.15,23 39.15,21.85 38.9,21.6 36.1,21.6 35.5,21 35.5,18.8 31.3,14.6 31.3,12.2 29.41,10.31 X102.4
SERIAL2_RX
  Top 0.3: K101.D9 X102.11
  Bottom 0.25: K101.D9 27.2,29.37 27.2,31.25 27.85,31.9 29.35,31.9 30.5,33.05 30.5,34.4 32.9,36.8 X113.2
SERIAL2_TX
  Top 0.3: K101.D10 X102.12
  Bottom 0.25: X102.12 30.53,30.63 31.1,31.2 31.1,34.2 31.7,34.8 X113.3
SPI_MISO  (via drill 0.35)
  Top 0.25: v6.1,31.95 22.16,31.95 K101.D12 | X102.14 31.19,35.71 33.15,33.75 35.1,33.75 35.3,33.95 35.3,35.6 35.5,35.8 37.5,35.8 37.9,35.4 R118.1 38.7,34.8 38.95,35.05 v38.95,35.4 42.9,35.4 43.3,35 43.3,31.39 C113.2 43.29,29.36 44.1,28.55 44.1,26.6 44.3,26.4 45.3,26.4 45.7,26 v45.7,24.4
  Top 0.3: K101.D12 X102.14
  Bottom 0.25: v6.1,31.95 4.91,30.76 X110.1 | X112.7 42.5,34.2 41.9,33.6 40.75,33.6 v38.95,35.4 | v45.7,24.4 45.7,13.32 X111.MISO
SPI_MOSI  (via drill 0.35)
  Top 0.25: v23.5,29.4 13.5,29.4 7.5,29.4 3.9,25.8 3.9,24.74 X110.4 | X102.13 32.13,33.17 33.45,31.85 34.65,31.85 35.3,31.2 35.3,29.6 35.5,29.4 37.7,29.4 37.9,29.6 R120.1 v38.95,30.2 38.95,29.75 40.75,27.95 C113.5 v40.75,21.2
  Top 0.35: K101.D11 X102.13
  Bottom 0.25: K101.D11 25.47,33.17 23.5,31.2 v23.5,29.4 | X112.3 46.9,34 44.5,31.6 40.35,31.6 v38.95,30.2 | v40.75,21.2 40.75,15.89 X111.MOSI
SPI_SCK  (via drill 0.35)
  Top 0.25: R115.1 v38.95,32.2 39.7,31.45 39.7,30.2 42.02,27.88 C113.6 42.02,21.21 v42,21.2 | X105.14 5.3,32.87 5.3,28 4.1,26.8 3.5,26.8 3.42,26.8 X110.3
  Top 0.3: X105.14 K101.D13
  Bottom 0.25: X112.5 44.7,33.2 43.7,32.2 v38.95,32.2 36.3,32.2 36.1,32.4 36.1,39.95 35.3,40.75 8.1,40.75 6.9,39.55 6.9,36.95 X105.14 | v42,21.2 42,16.9 43.1,15.8 43.2,15.7 43.2,13.36 X111.SCK
T3_VIN
  Top 0.5: SJ103.2 11.37,2 K101.VIN X105.1
TFT_BACKLIGHT
  Top 0.25: X105.7 6.3,19.7 6.3,20.6 5.5,21.4 5.1,21.8 SJ104.1
  Top 0.3: X105.7 K101.A6
TFT_CS
  Top 0.25: X105.4 7.19,10.31 5.9,11.6 4.5,11.6 3.9,12.2 3.9,13.92 X110.7 3.38,16.6 4.1,16.6 4.3,16.8 R116.1
  Top 0.3: K101.A9 X105.4
TFT_D/C
  Top 0.3: X105.12 K101.A1
  Bottom 0.25: X110.5 3.9,20.6 4.5,21.2 6.5,23.2 6.5,30 7.13,30.63 X105.12
VBAT
  Top 0.4: 20.9,6.6 23.7,6.6 24.3,6 24.3,2 24.9,1.4 32.3,1.4 33.1,2.2 C103.1 34.7,5.8 36.2,7.3 CN101.1
  Top 0.5: Q101.3 20.7,7 20.9,6.8 20.9,6.6 T101.3
VUSB  (via drill 0.4)
  Top 0.45: C102.1 T101.4
  Top 0.5: K101.VUSB 16.3,5.23 | 16.3,5.23 C102.1 | 16.3,5.23 R106.A | Q101.1 R104.2 v21.9,7.8 | v18.1,6.2 T101.4
  Bottom 0.5: v21.9,7.8 19.7,7.8 v18.1,6.2

### Text on the board
tPlace: PGM | A14 | 30 | 29 | 28 | 27 | 26 | 25 | 24 | VBAT | 13 | 12 | PWR | A0 | A0 | 11 | A1 | 10 | INT1 | INT2 | DRDYM | A2 | 9 | A3 | 8 | A4 | 7 | A5 | 6 | INT4 | INT3 | INT5 | A6 | A11 | 5 | NRF24 | A7 | 4 | ACC | GYR | MAG | A10 | A8 | x | 3 | A9 | y | AREF | 2 | z | 3V3 | 1 | AGND | 0 | CHG | GND | !LSINT | VIN
bPlace: LiBat | + | -
tDocu: MCU / ----------------- / TEENSY 3.1 (MK20DX256VLH7 (72 MHZ ARM M4)) / WITH REAL TIME CLOCK / / DISPLAY / ----------------- / 2.2" LCD / / POWER / ----------------- / LION CHARGER / 3.3V/400mA LDO / / COMMUNICATION / ----------------- / XBEE (WLAN/ZIGBEE) / NRF24 (2.4GHZ RF) / / MEMORY / ----------------- / SPI SERIAL FLASH / 2X I2C EEPROM / MICRO SD CARD / / SENSORS / ----------------- / UV INDEX/AMBIENT LIGHT SENSOR / BAROMETRIC/HUMIDITY/TEMPERATURE SENSOR / 9DOF SENSOR